# Altium schematic sheet RS232.SchDoc: RS232
size OrCAD A; DocumentNumber: LM-003; Revision: 3.0; SheetNumber: 4; SheetTotal: 5
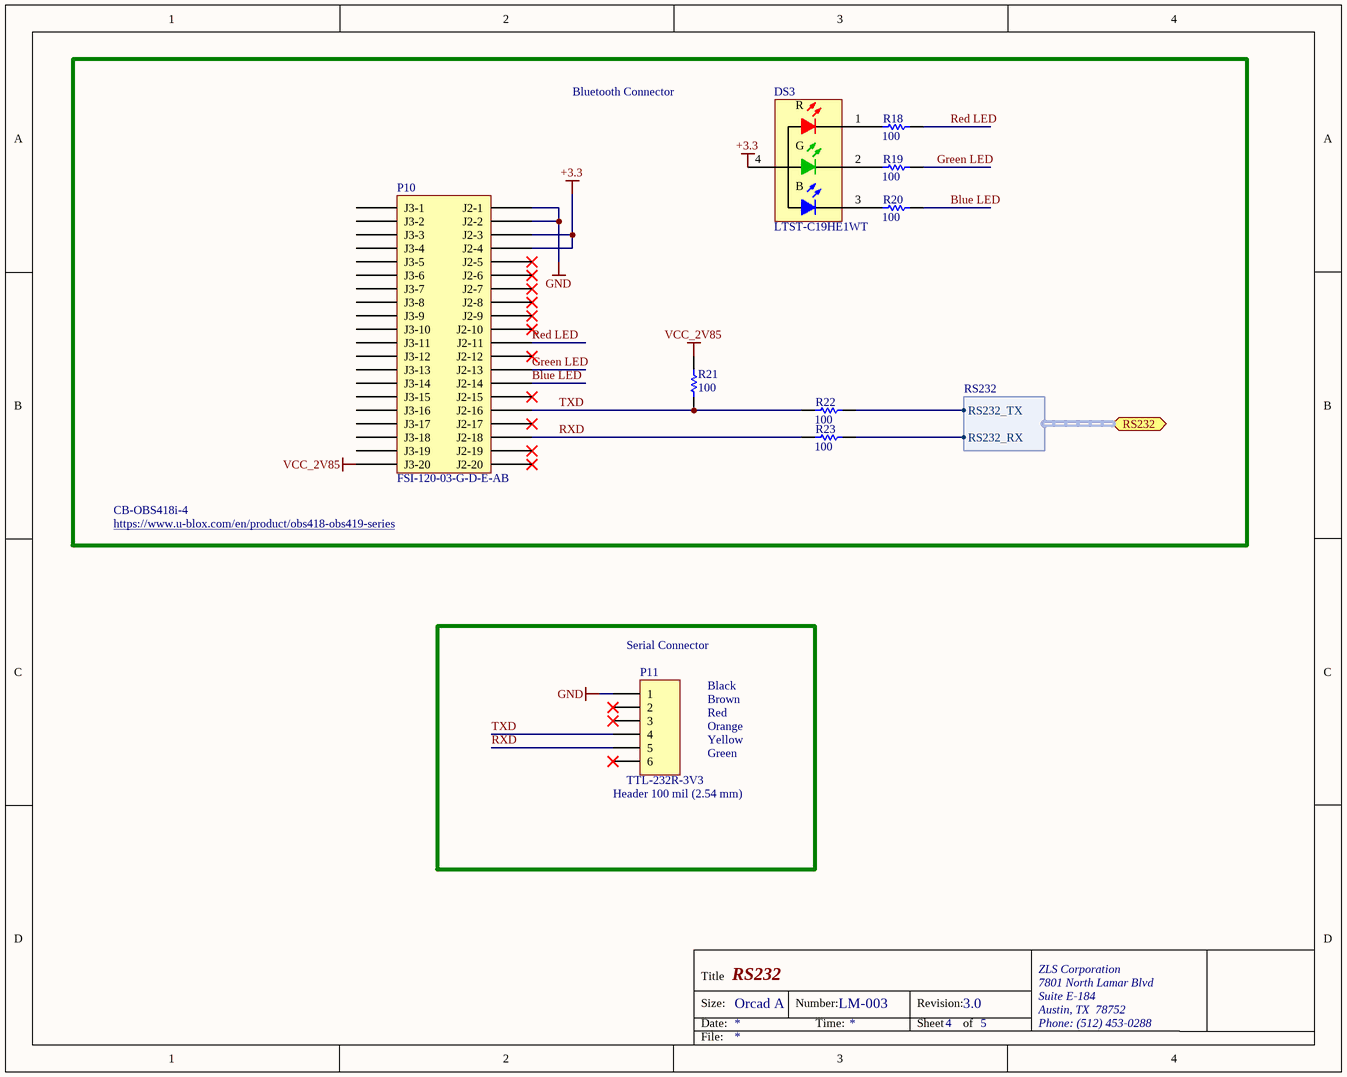
[diagram p0: RS232.SchDoc]

## Parts
DS3  LTST-C19HE1WT  [LTST-C19HE1WT-4_V]
P10  FSI-120-03-G-D-E-AB  [FSI-120-03-G-D-E-AB]
P11  Header 100 mil (2.54 mm)  [HDR1X6]
R18  100  [RESC0402(1005)_M]
R19  100  [RESC0402(1005)_M]
R20  100  [RESC0402(1005)_M]
R21  100  [RESC0402(1005)_M]
R22  100  [RESC0402(1005)_M]
R23  100  [RESC0402(1005)_M]

## Ports
RS232 (harness RS232)

## Harnesses
RS232: RS232_RX, RS232_TX

## Nets
+3.3: DS3.4(A) P10.J2-3 P10.J2-4
GND: P10.J2-1 P10.J2-2 P11.1
VCC_2V85: P10.J3-20 R21.2
Blue LED: P10.J2-14 R20.2
Green LED: P10.J2-13 R19.2
Red LED: P10.J2-11 R18.2
RXD: P10.J2-18 P11.5 R23.1
TXD: P10.J2-16 P11.4 R21.1 R22.1
NetDS3_1: DS3.1(R) R18.1
NetDS3_2: DS3.2(G) R19.1
NetDS3_3: DS3.3(B) R20.1
NetR22_2: R22.2 ; port RS232.RS232_TX
NetR23_2: R23.2 ; port RS232.RS232_RX

Not connected (* = marked no-connect by the designer): P10 J2-5* J2-6* J2-7* J2-8* J2-9* J2-10* J2-12* J2-15* J2-17* J2-19* J2-20* J3-1 J3-2 J3-3 J3-4 J3-5 J3-6 J3-7 J3-8 J3-9 J3-10 J3-11 J3-12 J3-13 J3-14 J3-15 J3-16 J3-17 J3-18 J3-19; P11 2* 3* 6*

## Notes on the sheet
- Bluetooth Connector
- CB-OBS418i-4
- https://www.u-blox.com/en/product/obs418-obs419-series
- (near P11) Serial Connector
- Black
- Brown
- Red
- Orange
- Yellow
- Green
- (near P11) TTL-232R-3V3
- Title
- Size:
- Date:
- Orcad A
- Number:
- Time:
- Revision:
- Sheet
- of
- ZLS Corporation
- 7801 North Lamar Blvd
- Suite E-184
- Austin, TX  78752
- Phone: (512) 453-0288
- File:

## Library data of the parts
DS3 = CMP-2000-05201-1: LED Tri-Color Blue/Green/Red, 5 V, -20 to 80 degC, 4-Pin SMD, RoHS, Tape and Reel; Manufacturer: Lite-On; Viewing Angle: 130deg; Forward Voltage: 2.4(Red)V,3.9(Blue)V,3.9(Green)V; Lens Shape: Rectangle; LED Material: AlInGaP(Red),InGaN(Blue),InGaN(Green); Dominant Wavelength: 470/525/624nm; Luminous Intensity: 180mcd,450mcd; Number of LEDs: 3; LED Colours: Blue,Green,Red; Lens Colour: Clear; Number of Pins: 3; Series: LTST; Mounting Type: SurfaceMount; Datasheet URL: http://download.siliconexpert.com/pdfs/2014/3/25/6/41/6/148/lot_/manual/s_110_ltst-c19he1wt.pdf; Manufacturer URL: http://www.us.liteon.com/; Datasheet Version: Rev. B, 10/2013; Dimensions: 1.6x1.6x0.35mm
P11 = Header 6H: CABLE USB SERIAL 3.3V 2MM HEADER; Manufacturer 1: FTDI, Future Technology Devices International Ltd; Manufacturer Part Number 1: TTL-232R-3V3-2MM; Category 1: Cable Assemblies; Usage: USB to TTL Serial 3.3V; Convert From (Adapter End): USB - A, Plug; Convert To (Adapter End): Rectangular Connector, Female Sockets, 8 pos (7 open), 2mm; Shielding: Unshielded; Supplier 1: Digi-Key; Supplier Part Number 1: 768-1095-ND; RoHS 1: RoHS Compliant; Description 1: CABLE USB SERIAL 3.3V 2MM HEADER; Stock 1: 274; Pricing 1: 1=20, 10=18, 50=16.875 (USD); Part Status: Active; Length: 5.90' (1.80m); ComponentLink1URL: http://www.ftdichip.com/Support/Documents/DataSheets/Cables/DS_TTL-232R_CABLES.pdf; ComponentLink1Description: http://www.ftdichip.com/Support/Documents/DataSheets/Cables/DS_TTL-232R_CABLES.pdf
R18-R23 = CMP-1011-00651-1
P10 = FSI-120-03-G-D-E-AB: Supplier 1: Avnet; Supplier Part Number 1: FSI-120-03-G-D-E-AB